# Altium schematic sheet MB1297_STLINK_V2-1.SCHDOC: ST-LINK/V2-1 with support of SWD only
size A4; DocumentNumber: MB1297; Revision: C; SheetNumber: 11; SheetTotal: 11
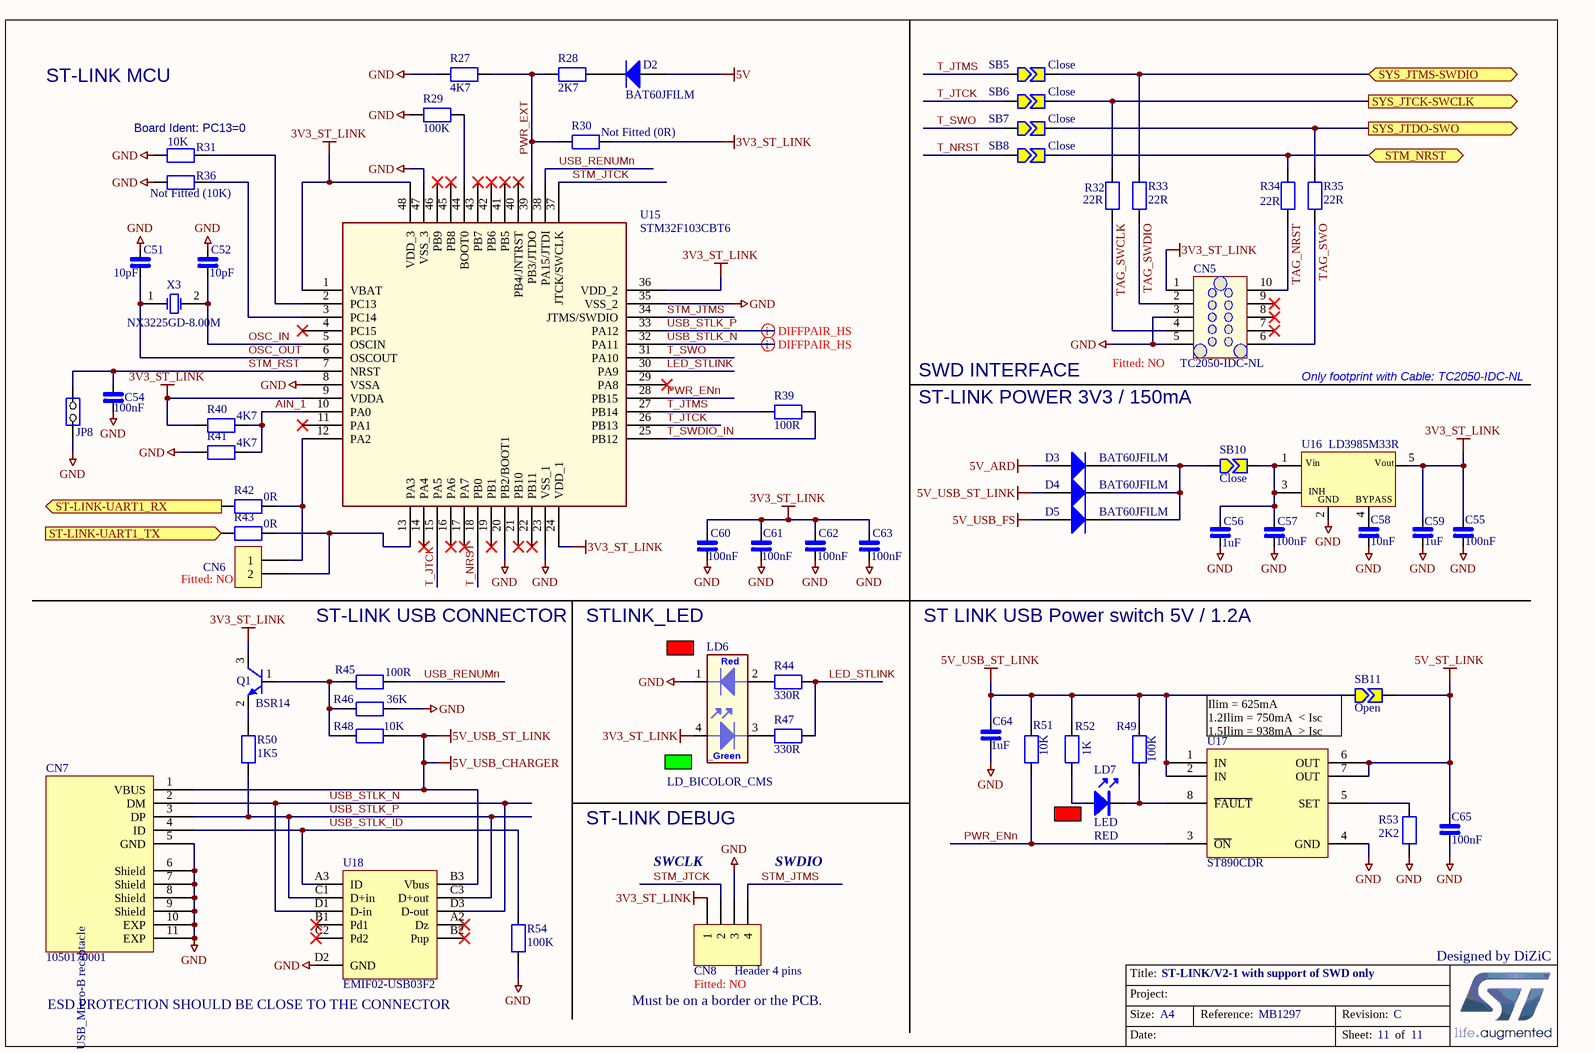
[diagram p0: MB1297_STLINK_V2-1.SCHDOC]

## Parts
C51  10pF  [0402_CAP_NPOL]
C52  10pF  [0402_CAP_NPOL]
C54  100nF  [0402_CAP_NPOL]
C55  100nF  [0402_CAP_NPOL]
C56  1uF  [0402_CAP_NPOL]
C57  100nF  [0402_CAP_NPOL]
C58  10nF  [0402_CAP_NPOL]
C59  1uF  [0402_CAP_NPOL]
C60  100nF  [0402_CAP_NPOL]
C61  100nF  [0402_CAP_NPOL]
C62  100nF  [0402_CAP_NPOL]
C63  100nF  [0402_CAP_NPOL]
C64  1uF  [0402_CAP_NPOL]
C65  100nF  [0402_CAP_NPOL]
CN5  TC2050-IDC-NL  Fitted: NO  [CON_TAG-C_TC2050-IDC-NL]
CN6  Fitted: NO  [CON_SAMTEC_TSW-102-07-G-S]  (hidden comment: header 2 pins 2.54mm)
CN7  1050170001  [CON_USBMICROB_MOLEX_105017-0001_H2P90]
CN8  Header 4 pins  Fitted: NO  [CON_SAMTEC_TSW-104-07-G-S]
D2  BAT60JFILM  [DIO_SOD323]
D3  BAT60JFILM  [DIO_SOD323]
D4  BAT60JFILM  [DIO_SOD323]
D5  BAT60JFILM  [DIO_SOD323]
JP8  Jumper_2.54mm  [CON_SAMTEC_TSW-102-07-G-S]  (value not drawn)
LD6  LD_BICOLOR_CMS  [LED_BI-GR_HSMF-A201-A00J1]
LD7  LED  Color: RED  [0603_LED_RED]
Q1  BSR14  [SOT23-3]
R27  4K7  [0402_RES]
R28  2K7  [0402_RES]
R29  100K  [0402_RES]
R30  Not Fitted (0R)  [0402_RES]
R31  10K  [0402_RES]
R32  22R  [0402_RES]
R33  22R  [0402_RES]
R34  22R  [0402_RES]
R35  22R  [0402_RES]
R36  Not Fitted (10K)  [0402_RES]
R39  100R  [0402_RES]
R40  4K7  [0402_RES]
R41  4K7  [0402_RES]
R42  0R  [0402_RES]
R43  0R  [0402_RES]
R44  330R  [0402_RES]
R45  100R  [0402_RES]
R46  36K  [0402_RES]
R47  330R  [0402_RES]
R48  10K  [0402_RES]
R49  100K  [0402_RES]
R50  1K5  [0402_RES]
R51  10K  [0402_RES]
R52  1K  [0402_RES]
R53  2K2  [0402_RES]
R54  100K  [0402_RES]
SB5  Close  [SB]
SB6  Close  [SB]
SB7  Close  [SB]
SB8  Close  [SB]
SB10  Close  [SB]
SB11  Open  [SB]
U15  STM32F103CBT6  [ICC_LQFP48_7X7_P050]
U16  LD3985M33R  [REG_SOT23-5L]
U17  ST890CDR  [ICC_SO8_5X4_P127]
U18  EMIF02-USB03F2  [ESD_FLIP-CHIP-BGA11_1P44X1P94_P050]
X3  NX3225GD-8.00M  [CRY_NX3225GD_2P]

## Ports
ST-LINK-UART1_RX, ST-LINK-UART1_TX, STM_NRST, SYS_JTCK-SWCLK, SYS_JTDO-SWO, SYS_JTMS-SWDIO

## Nets
3V3_ST_LINK: C55.1 C59.1 C60.1 C61.1 C62.1 C63.1 CN5.1 CN8.1 LD6.4 Q1.3(C) R30.1 R40.2 U15.1(VBAT) U15.9(VDDA) U15.24(VDD_1) U15.36(VDD_2) U15.48(VDD_3) U16.5(Vout)
5V: D2.1(A)
5V_ARD: D3.1(A)
5V_ST_LINK: C65.1 SB11.1 U17.6(OUT) U17.7(OUT)
5V_USB_CHARGER: C64.1 CN7.1(VBUS) D4.1(A) R48.1 R49.2 R51.2 R52.2 SB11.2 U17.1(IN) U17.2(IN) U18.B3(Vbus)  [also labelled 5V_USB_ST_LINK]
5V_USB_FS: D5.1(A)
GND: C51.1 C52.1 C54.2 C55.2 C56.2 C57.2 C58.2 C59.2 C60.2 C61.2 C62.2 C63.2 C64.2 C65.2 CN5.3 CN5.5 CN7.5(GND) CN7.6(Shield) CN7.7(Shield) CN7.8(Shield) CN7.9(Shield) CN7.10(EXP) CN7.11(EXP) CN8.3 JP8.1(COMMON) LD6.1 R27.2 R29.2 R31.2 R36.2 R41.2 R46.1 R53.1 R54.2 U15.8(VSSA) U15.20(PB2/BOOT1) U15.23(VSS_1) U15.35(VSS_2) U15.47(VSS_3) U16.2(GND) U17.4(GND) U18.D2(GND)
AIN_1: R40.1 R41.1 U15.10(PA0)
LED_STLINK: R44.1 R47.1 U15.30(PA9)
OSC_IN: C52.2 U15.5(OSCIN) X3.2(OSC2)
OSC_OUT: C51.2 U15.6(OSCOUT) X3.1(OSC1)
PWR_ENn: R51.1 U15.28(PB15) U17.3(~{ON})
PWR_EXT: R27.1 R28.2 R30.2 U15.39(PB3/JTDO)
ST-LINK-UART1_RX: R42.2 ; port ST-LINK-UART1_RX
ST-LINK-UART1_TX: R43.2 ; port ST-LINK-UART1_TX
STM_JTCK: CN8.2 U15.37(JTCK/SWCLK)
STM_JTMS: CN8.4 U15.34(JTMS/SWDIO)
STM_NRST: R34.2 SB8.1 ; port STM_NRST
STM_RST: C54.1 JP8.2(NO) U15.7(NRST)
SYS_JTCK-SWCLK: R32.2 SB6.1 ; port SYS_JTCK-SWCLK
SYS_JTDO-SWO: R35.2 SB7.1 ; port SYS_JTDO-SWO
SYS_JTMS-SWDIO: R33.2 SB5.1 ; port SYS_JTMS-SWDIO
T_JTCK: SB6.2 U15.15(PA5) U15.26(PB13)
T_JTMS: R39.2 SB5.2 U15.27(PB14)
T_NRST: SB8.2 U15.18(PB0)
T_SWDIO_IN: R39.1 U15.25(PB12)
T_SWO: SB7.2 U15.31(PA10)
TAG_NRST: CN5.10 R34.1
TAG_SWCLK: CN5.4 R32.1
TAG_SWDIO: CN5.2 R33.1
TAG_SWO: CN5.6 R35.1
USB_RENUMn: R45.1 U15.38(PA15/JTDI)
USB_STLK_ID: CN7.4(ID) R54.1 U18.A3(ID)
USB_STLK_N: CN7.2(DM) U15.32(PA11) U18.D1(D-in) U18.D3(D-out)
USB_STLK_P: CN7.3(DP) R50.2 U15.33(PA12) U18.C1(D+in) U18.C3(D+out)
NetC56_1: C56.1 C57.1 SB10.1 U16.1(Vin) U16.3(CE)
NetC58_1: C58.1 U16.4(BYPASS)
NetCN6_1: CN6.1 R42.1 U15.12(PA2)
NetCN6_2: CN6.2 R43.1 U15.13(PA3)
NetD2_2: D2.2(K) R28.1
NetD3_2: D3.2(K) D4.2(K) D5.2(K) SB10.2
NetLD6_2: LD6.2 R44.2
NetLD6_3: LD6.3 R47.2
NetLD7_A: LD7.A R52.1
NetLD7_K: LD7.K R49.1 U17.8(~{FAULT})
NetQ1_1: Q1.1(B) R45.2 R46.2 R48.2
NetQ1_2: Q1.2(E) R50.1
NetR29_1: R29.1 U15.44(BOOT0)
NetR31_1: R31.1 U15.2(PC13)
NetR36_1: R36.1 U15.3(PC14)
NetR53_2: R53.2 U17.5(SET)

Not connected (* = marked no-connect by the designer): CN5 7* 8* 9*; U15 4(PC15)* 11(PA1)* 14(PA4)* 16(PA6)* 17(PA7)* 19(PB1)* 21(PB10)* 22(PB11)* 29(PA8)* 40(PB4/JNTRST)* 41(PB5)* 42(PB6)* 43(PB7)* 45(PB8)* 46(PB9)*; U18 A2(Dz)* B1(Pd1)* B2(Pup)* C2(Pd2)*

## Layout directives
differential pair: USB_STLK_N, USB_STLK_P

## Notes on the sheet
- ST-LINK MCU
- (near R31) Board Ident: PC13=0
- SWD INTERFACE
- Only footprint with Cable: TC2050-IDC-NL
- ST-LINK POWER 3V3 / 150mA
- ST-LINK USB CONNECTOR
- STLINK_LED
- ST LINK USB Power switch 5V / 1.2A
- (near SB11) Ilim = 625mA
  1.2Ilim = 750mA  < Isc
  1.5Ilim = 938mA  > Isc
- ST-LINK DEBUG
- SWCLK
- SWDIO
- Must be on a border or the PCB.
- Designed by DiZiC
- (near U18) ESD PROTECTION SHOULD BE CLOSE TO THE CONNECTOR
- Title:
- Project:
- Size:
- Date:
- A4
- Reference:
- Sheet:
- Revision:
- of
- (in symbol 1050170001) USB_Micro-B receptacle
- (in symbol LD3985M33R) INH
- (in symbol LD_BICOLOR_CMS) Red; _Green

## Library data of the parts
C51 C52 C54-C65 = CAP_NPOL: Capacitor_not polarized
CN5 = Tag-10-C: Tag_Connector Header, 10-Pin, Dual row No legs; Manuf_Part_1: TC2050-IDC-NL-FP; Ordered_By: Subcon; Distrib: *; ECCN_US/EU: n/a; Manuf_1: Tag_connect; Order_code: *; Value: TC2050-IDC-NL
CN6 = Header 2 pins: Manuf_1: SAMTEC; Manuf_Part_2: 4711955140470; Manuf_2: KONTEC; Manuf_Part_1: TSW-102-07-x-S; Order_Code: 423-2841; Ordered_By: Subcon; ECCN_US/EU: n/a; Value: header 2 pins 2.54mm
CN7 = 1050170001: USB-MICRO-B, 1050170001, SMT, MOLEX; Fitted: YES; Ordered_By: Subcon; ECCN_US/EU: n/a; Manuf_1: MOLEX; Manuf_Part_1: 1050170001; Distrib: DIGIKEY; Value: 1050170001; Order_Code: *
CN8 = Header 4: Header, 4-Pin; Manuf_1: Samtec; Manuf_Part_1: TSW-104-07-x-S; Ordered_By: Subcon; ECCN_US/EU: n/a; Distrib: *; Order_Code: *; Value: Header 4 pins
D2-D5 = BAT60JFILM: Manuf_1: STM; ECCN_US/EU: EAR99/NEC; Ref St: 9151097; Fitted: YES; Manuf_Part_1: BAT60JFILM; Distrib: ST; Order_Code: BAT60JFILM; Ordered_By: STM
JP8 = TSW-102-07-x-S: Connector jumper 1 position; Manuf_1: SAMTEC; Manuf_Part_2: 4711955140470; Manuf_2: KONTEC; Order_Code: 423-2841; Fitted: YES; Ordered_By: Subcon; ECCN_US/EU: n/a; Value: Jumper_2.54mm; Manuf_Part_1: TSW-102-07-x-S
LD6 = LD_BICOLOR_CMS: Bicolor Led; Manuf_Part_1: HSMF-A201-A00J1; Manuf_1: Avago Technologies; Manuf_2: everluck; Manuf_Part_2: LE-RGW35280; ECCN_US/EU: EAR99/NEC; Fitted: YES; Ordered_By: Subcon; Distrib: RADIOSPARES; Value: LD_BICOLOR_CMS
LD7 = LED: Light-Emitting Diode; Part Number A: *
Q1 = BSR14: BSR14 NPN switching transistor SOT23 (Marking U8)
R27-R29 R31-R35 R39-R54 = RES: Resistor
R30 R36 = RES: Resistor; FITTED: NO
SB5-SB8 SB10 SB11 = Strap2: Solder Jumper; Solder: YES; Published: 24-Mar-1999; Revision: July-2002: Re-released for DXP Platform.; Publisher: Altium Limited
U15 = STM32F103CBT6: Medium-density performance line ARM-based 32-bit MCU with 128KB Flash; Manuf_1: STM; ECCN_US/EU: 3A991A2/NEC; Fitted: YES; Manuf_Part_1: STM32F103CBT6; Distrib: STM; Order_Code: STM32F103CBT6; Ordered_By: STM; Value: STM32F103CBT6
U16 = LD3985M33R: Ultra low drop-low noise BiCMOS voltage, regulators low ESR capacitors compatible; Manuf_1: STM; Ref St: 9176161; ECCN_US/EU: EAR99/NEC; Fitted: YES; Manuf_Part_1: LD3985M33R; Distrib: STM; Ordered_By: STM; Order_Code: LD3985M33R; Value: LD3985M33R
U17 = ST890CDR: 1.2 A current limited high-side power switch with thermal shutdown; Manuf_1: STM; ECCN_US/EU: EAR99/NEC; Fitted: YES; Manuf_Part_1: ST890CDR; Distrib: STM; Ordered_By: STM; Order_Code: *; Value: ST890CDR
U18 = EMIF02-USB03F2: 2-line IPAD, EMI filter including ESD protection; Manuf_1: STM; ECCN_US/EU: EAR99/NEC; Fitted: YES; REF_STM: 9179037; Manuf_Part_1: EMIF02-USB03F2; Distrib: ST; Order_code: EMIF02-USB03F2; Ordered_By: STM; Value: EMIF02-USB03F2
X3 = XTAL_8M_NX3225GD: Crystal 8Mhz, 8pF, -+50PPM, SMD; Manuf_1: NDK; Manuf_Part_1: NX3225GD 8MHz EXS00A-CG04874; ECCN_US/EU: EAR99/NEC; NDK Ref: X3127326; Ref St: 9157029; Fitted: YES; Ordered_By: STM; Order_Code: NX3225GD 8MHz EXS00A-CG04874; Distrib: *; Value: NX3225GD-8.00M